# EAGLE schematic F4Z6Y7PIP1H1BGX (EAGLE 6.2)
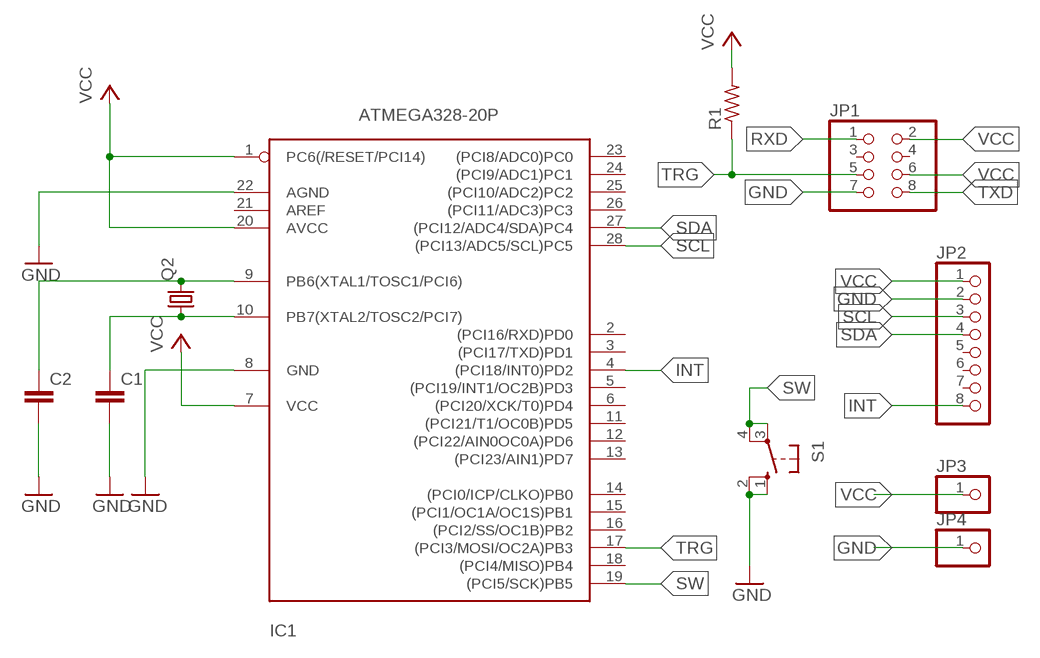
[diagram p0: schematic, sheet 1]

## Parts
C1  C2,5-3  [C2.5-3]
C2  C2,5-3  [C2.5-3]
IC1  ATMEGA328-20P  [DIL28-3]
JP1  PINHD-2X4  [2X04]
JP2  PINHD-1X8/90  [1X08/90]
JP3  PINHD-1X1  [1X01]
JP4  PINHD-1X1  [1X01]
Q2  CRYSTALHC49S  [HC49/S]
R1  R-US_0204/7  [0204/7]
S1  10-XX  [B3F-10XX]

## Nets
GND: C1.2 C2.2 IC1.8(GND) IC1.22(AGND) JP1.7 JP2.2 JP4.1 S1.1(S) S1.2(S1)
INT: IC1.4((PCI18/INT0)PD2) JP2.8
N$6: C2.1 IC1.9(PB6(XTAL1/TOSC1/PCI6)) Q2.2
N$7: C1.1 IC1.10(PB7(XTAL2/TOSC2/PCI7)) Q2.1
RXD: JP1.1
SCL: IC1.28((PCI13/ADC5/SCL)PC5) JP2.3
SDA: IC1.27((PCI12/ADC4/SDA)PC4) JP2.4
SW: IC1.19((PCI5/SCK)PB5) S1.3(P) S1.4(P1)
TRG: IC1.17((PCI3/MOSI/OC2A)PB3) JP1.5 R1.1
TXD: JP1.8
VCC: IC1.1(PC6(/RESET/PCI14)) IC1.7(VCC) IC1.20(AVCC) JP1.2 JP1.6 JP2.1 JP3.1 R1.2
Unconnected: IC1.2((PCI16/RXD)PD0) IC1.3((PCI17/TXD)PD1) IC1.5((PCI19/INT1/OC2B)PD3) IC1.6((PCI20/XCK/T0)PD4) IC1.11((PCI21/T1/OC0B)PD5) IC1.12((PCI22/AIN0OC0A)PD6) IC1.13((PCI23/AIN1)PD7) IC1.14((PCI0/ICP/CLKO)PB0) IC1.15((PCI1/OC1A/OC1S)PB1) IC1.16((PCI2/SS/OC1B)PB2) IC1.18((PCI4/MISO)PB4) IC1.21(AREF) IC1.23((PCI8/ADC0)PC0) IC1.24((PCI9/ADC1)PC1) IC1.25((PCI10/ADC2)PC2) IC1.26((PCI11/ADC3)PC3) JP1.3 JP1.4 JP2.5 JP2.6 JP2.7

## Library data of the parts
C1 C2 = capacitor-wima:C: CAPACITOR naming: grid - package width
IC1 = atmega328:ATMEGA328*P: MICROCONTROLLER 32 kBytes FLASH 2 kBytes SRAM 1 kBytes EEPROM USART 8-channel 10 bit ADC
JP1 = pinhead:PINHD-2X4: PIN HEADER
JP2 = pinhead:PINHD-1X8: PIN HEADER
JP3 JP4 = pinhead:PINHD-1X1: PIN HEADER
Q2 = crystal:CRYSTAL: CRYSTAL; OC_FARNELL: 1667008; OC_NEWARK: unknown
R1 = rcl:R-US_: RESISTOR, American symbol
S1 = switch-omron:10-XX: OMRON SWITCH; MPN: B3F-1000; OC_FARNELL: 176432; OC_NEWARK: 36M3542